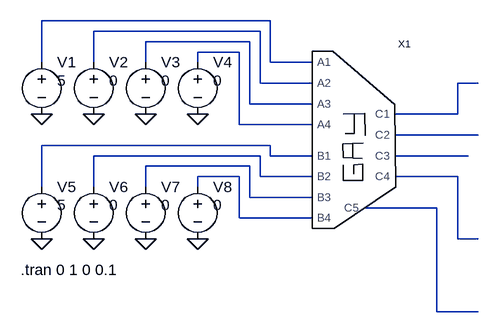
[diagram p0: schematic test.asc]
test.asc, the LTspice schematic file:
Version 4
SHEET 1 880 680
WIRE 128 -32 -224 -32
WIRE 112 -16 -144 -16
WIRE 96 0 -64 0
WIRE 80 16 16 16
WIRE -224 32 -224 -32
WIRE -144 32 -144 -16
WIRE -64 32 -64 0
WIRE 16 32 16 16
WIRE 128 32 128 -32
WIRE 192 32 128 32
WIRE 112 64 112 -16
WIRE 192 64 112 64
WIRE 448 64 416 64
WIRE 96 96 96 0
WIRE 192 96 96 96
WIRE 416 112 416 64
WIRE 416 112 320 112
WIRE 80 128 80 16
WIRE 192 128 80 128
WIRE 448 144 320 144
WIRE 128 160 -224 160
WIRE 112 176 -144 176
WIRE 128 176 128 160
WIRE 192 176 128 176
WIRE 432 176 320 176
WIRE 96 192 -64 192
WIRE 80 208 16 208
WIRE 112 208 112 176
WIRE 192 208 112 208
WIRE 416 208 320 208
WIRE -224 224 -224 160
WIRE -144 224 -144 176
WIRE -64 224 -64 192
WIRE 16 224 16 208
WIRE 96 240 96 192
WIRE 192 240 96 240
WIRE 384 256 272 256
WIRE 80 272 80 208
WIRE 192 272 80 272
WIRE 416 304 416 208
WIRE 448 304 416 304
WIRE 384 416 384 256
WIRE 448 416 384 416
FLAG -224 112 0
FLAG -144 112 0
FLAG -64 112 0
FLAG 16 112 0
FLAG 16 304 0
FLAG -64 304 0
FLAG -144 304 0
FLAG -224 304 0
SYMBOL voltage -224 16 R0
WINDOW 3 24 44 Left 2
WINDOW 123 0 0 Left 0
WINDOW 39 0 0 Left 0
SYMATTR Value 5
SYMATTR InstName V1
SYMBOL voltage -144 16 R0
WINDOW 3 24 44 Left 2
WINDOW 123 0 0 Left 0
WINDOW 39 0 0 Left 0
SYMATTR Value 0
SYMATTR InstName V2
SYMBOL voltage -64 16 R0
WINDOW 3 24 44 Left 2
WINDOW 123 0 0 Left 0
WINDOW 39 0 0 Left 0
SYMATTR Value 0
SYMATTR InstName V3
SYMBOL voltage 16 16 R0
WINDOW 3 24 44 Left 2
WINDOW 123 0 0 Left 0
WINDOW 39 0 0 Left 0
SYMATTR Value 0
SYMATTR InstName V4
SYMBOL voltage -224 208 R0
WINDOW 3 24 44 Left 2
WINDOW 123 0 0 Left 0
WINDOW 39 0 0 Left 0
SYMATTR Value 5
SYMATTR InstName V5
SYMBOL voltage -144 208 R0
WINDOW 3 24 44 Left 2
WINDOW 123 0 0 Left 0
WINDOW 39 0 0 Left 0
SYMATTR Value 0
SYMATTR InstName V6
SYMBOL voltage -64 208 R0
WINDOW 3 24 44 Left 2
WINDOW 123 0 0 Left 0
WINDOW 39 0 0 Left 0
SYMATTR Value 0
SYMATTR InstName V7
SYMBOL voltage 16 208 R0
WINDOW 3 24 44 Left 2
WINDOW 123 0 0 Left 0
WINDOW 39 0 0 Left 0
SYMATTR Value 0
SYMATTR InstName V8
SYMBOL sum4 240 80 R0
SYMATTR InstName X1
TEXT -256 352 Left 2 !.tran 0 1 0 0.1

The netlist it stands for:
* test.asc
V1 N001 0 5
V2 N002 0 0
V3 N003 0 0
V4 N004 0 0
V5 N007 0 5
V6 N008 0 0
V7 N010 0 0
V8 N011 0 0
XX1 N001 N002 N003 N004 N007 N008 N010 N011 N005 N006 N009 N012 N013 sum4  ; pins A1 A2 A3 A4 B1 B2 B3 B4 C1 C2 C3 C4 С5
.tran 0 1 0 0.1
.backanno
.end